# EAGLE design midicontrol_v3 (EAGLE 9.4.0)
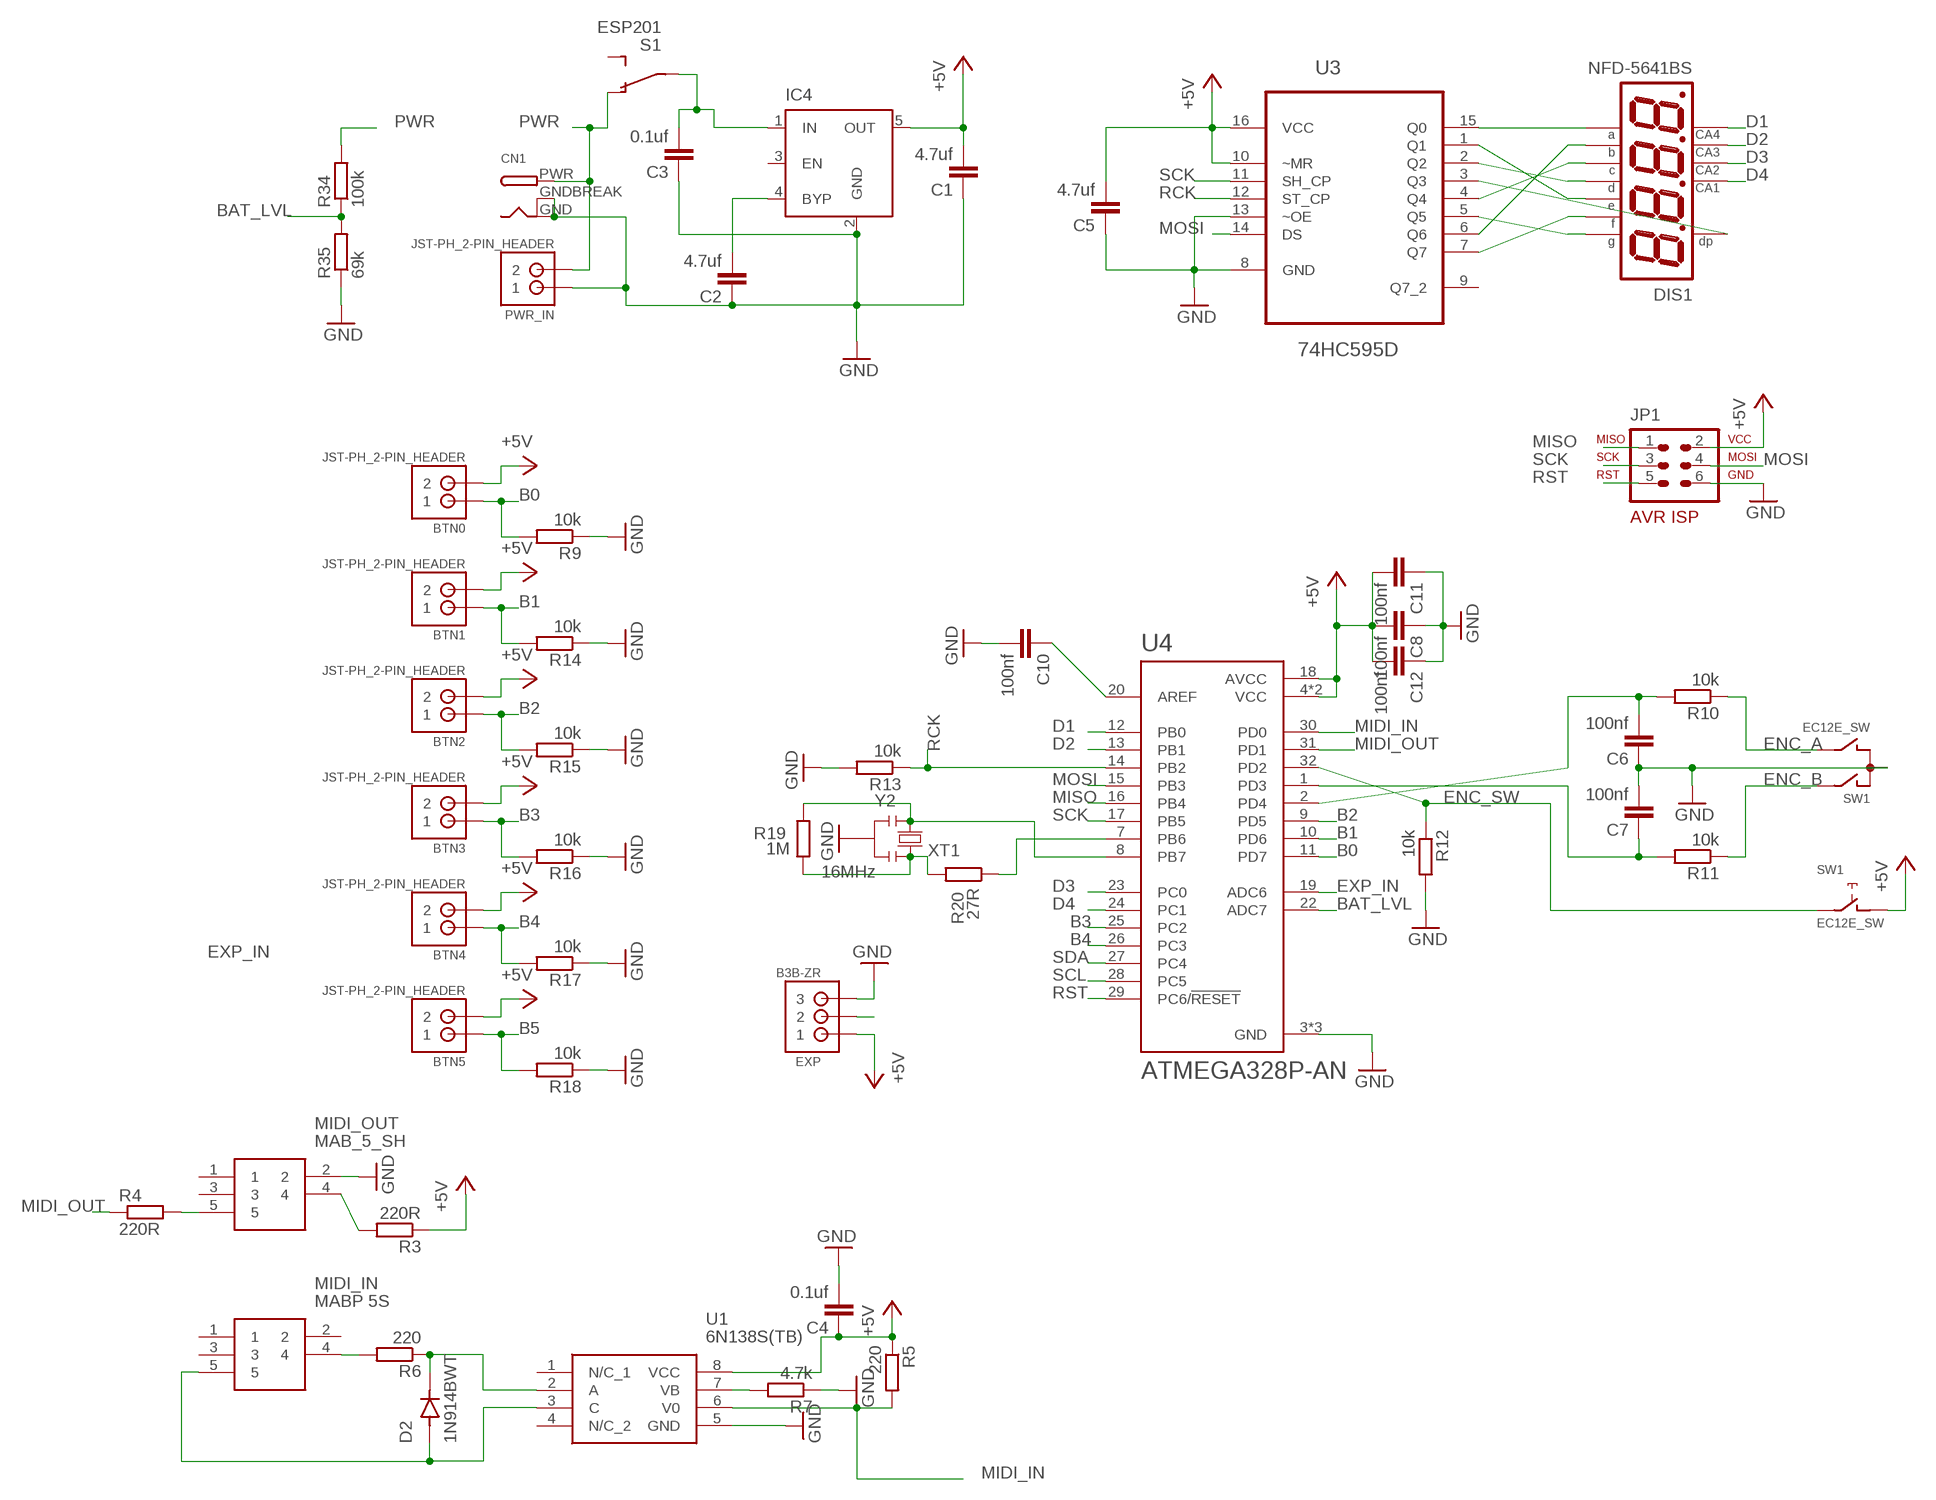
[diagram p0: schematic, sheet 1]

## Parts
BTN0  JST-PH_2-PIN_HEADER  [JST_B2B-PH_HEADER]
BTN1  JST-PH_2-PIN_HEADER  [JST_B2B-PH_HEADER]
BTN2  JST-PH_2-PIN_HEADER  [JST_B2B-PH_HEADER]
BTN3  JST-PH_2-PIN_HEADER  [JST_B2B-PH_HEADER]
BTN4  JST-PH_2-PIN_HEADER  [JST_B2B-PH_HEADER]
BTN5  JST-PH_2-PIN_HEADER  [JST_B2B-PH_HEADER]
C1  4.7uf  C-EUC1206  [C1206]
C2  4.7uf  C-EUC1206  [C1206]
C3  0.1uf  C-EUC1206  [C1206]
C4  0.1uf  C-EUC0603  [C0603]
C5  4.7uf  C-EUC0603  [C0603]
C6  100nf  C-EUC0603  [C0603]
C7  100nf  C-EUC0603  [C0603]
C8  100nf  C-EUC1206  [C1206]
C10  100nf  C-EUC0603  [C0603]
C11  100nf  C-EUC0603  [C0603]
C12  100nf  C-EUC0603  [C0603]
CN1  DCBARRELPTH  [DCJACK_2MM_PTH]
D2  1N914BWT  [SODFL1608X70N]
DIS1  NFD-5641BS  [NFD-5641]
EXP  B3B-ZR  [B3B-ZR]
IC4  MIC5219XX  [SOT23-5]
JP1  AVR-ISP-6HORZ  [AVR-ISP-6R]
MIDI_IN  MABP 5S  MAB_5_SH  [MAB-5-SH]
MIDI_OUT  MAB_5_SH  [MAB-5-SH]
PWR_IN  JST-PH_2-PIN_HEADER  [JST_B2B-PH_HEADER]
R3  220R  R-EU_R0603  [R0603]
R4  220R  R-EU_R0603  [R0603]
R5  220  R-EU_R0603  [R0603]
R6  220  R-EU_R0603  [R0603]
R7  4.7k  R-EU_R0603  [R0603]
R9  10k  R-EU_R0603  [R0603]
R10  10k  R-EU_R0603  [R0603]
R11  10k  R-EU_R0603  [R0603]
R12  10k  R-EU_R0603  [R0603]
R13  10k  R-EU_R0603  [R0603]
R14  10k  R-EU_R0603  [R0603]
R15  10k  R-EU_R0603  [R0603]
R16  10k  R-EU_R0603  [R0603]
R17  10k  R-EU_R0603  [R0603]
R18  10k  R-EU_R0603  [R0603]
R19  1M  R-EU_R0603  [R0603-ROUND]
R20  27R  R-EU_R0603  [R0603-ROUND]
R34  100k  R-EU_R0603  [R0603]
R35  69k  R-EU_R0603  [R0603]
S1  ESP201  [ESP201]
SW1  EC12E_SW  [ALPS_EC12E_SW]
U1  6N138S(TB)  [SOP254P1030X460-8N]
U3  74HC595D  [SOIC127P600X175-16N]
U4  ATMEGA328P-AN  [QFP80P900X900X120-32N]
Y2  16MHz  RESONATORMU  [RESONATOR]

## Nets
+5V: BTN0.P2 BTN1.P2 BTN2.P2 BTN3.P2 BTN4.P2 BTN5.P2 C1.2 C4.1 C5.2 C8.2 C11.2 C12.2 EXP.1 IC4.5(OUT) JP1.2 R3.1 R5.1 SW1.D U1.8(VCC) U3.10(~MR) U3.16(VCC) U4.4(VCC) U4.6(VCC) U4.18(AVCC)
B0: BTN0.P1 R9.2 U4.11(PD7)
B1: BTN1.P1 R14.2 U4.10(PD6)
B2: BTN2.P1 R15.2 U4.9(PD5)
B3: BTN3.P1 R16.2 U4.25(PC2)
B4: BTN4.P1 R17.2 U4.26(PC3)
B5: BTN5.P1 R18.2
BAT_LVL: R34.1 R35.2 U4.22(ADC7)
D1: DIS1.P$6 U4.12(PB0)
D2: DIS1.P$8 U4.13(PB1)
D3: DIS1.P$9 U4.23(PC0)
D4: DIS1.P$12 U4.24(PC1)
ENC_A: R10.1 SW1.B
ENC_B: R11.1 SW1.A
ENC_SW: R12.1 SW1.E U4.32(PD2)
EXP_IN: EXP.2 U4.19(ADC6)
GND: C1.1 C2.1 C3.1 C4.2 C5.1 C6.1 C7.2 C8.1 C10.2 C11.1 C12.1 CN1.GND CN1.GNDBREAK EXP.3 IC4.2(GND) JP1.6 MIDI_OUT.2 PWR_IN.P1 R7.1 R9.1 R12.2 R13.2 R14.1 R15.1 R16.1 R17.1 R18.1 R35.1 SW1.C U1.5(GND) U3.8(GND) U3.13(~OE) U4.3(GND) U4.5(GND) U4.21(GND) Y2.2
MIDI_IN: R5.2 U1.6(V0) U4.30(PD0)
MIDI_OUT: R4.1 U4.31(PD1)
MISO: JP1.1 U4.16(PB4)
MOSI: JP1.4 U3.14(DS) U4.15(PB3)
N$1: DIS1.P$11 U3.15(Q0)
N$2: DIS1.P$7 U3.6(Q6)
N$3: DIS1.P$4 U3.4(Q4)
N$4: DIS1.P$2 U3.2(Q2)
N$5: DIS1.P$1 U3.1(Q1)
N$6: DIS1.P$10 U3.7(Q7)
N$7: DIS1.P$5 U3.5(Q5)
N$8: DIS1.P$3 U3.3(Q3)
N$9: MIDI_OUT.4 R3.2
N$10: MIDI_OUT.5 R4.2
N$11: D2.A MIDI_IN.5 U1.3(C)
N$12: D2.C(K) R6.1 U1.2(A)
N$13: MIDI_IN.4 R6.2
N$14: R7.2 U1.7(VB)
N$15: C6.2 R10.2 U4.2(PD4)
N$16: R20.1 U4.7(PB6)
N$17: C7.1 R11.2 U4.1(PD3)
N$20: C2.2 IC4.4(BYP)
N$21: C10.1 U4.20(AREF)
N$26: C3.2 IC4.1(IN) S1.P$1(P)
PWR: CN1.PWR PWR_IN.P2 R34.2 S1.P$3(O)
RCK: R13.1 U3.12(ST_CP) U4.14(PB2)
RST: JP1.5 U4.29(PC6/!RESET)
SCK: JP1.3 U3.11(SH_CP) U4.17(PB5)
SCL: U4.28(PC5)
SDA: U4.27(PC4)
XT1: R19.1 R20.2 Y2.3
XTAL2: R19.2 U4.8(PB7) Y2.1
Unconnected: IC4.3(EN) MIDI_IN.1 MIDI_IN.2 MIDI_IN.3 MIDI_OUT.1 MIDI_OUT.3 S1.P$2(S) SW1.GND1(G) SW1.GND2(G) U1.1(N/C_1) U1.4(N/C_2) U3.9(Q7_2)

## Library data of the parts
BTN0 BTN1-BTN5 PWR_IN = srg:JST-PH_2-PIN_HEADER: 2-pin JST PH Shrouded Header, top entry P/N B2B-PH-K-S Mating connector PHR-2 Mating cable assembly: Sparkfun PRT-09914 <http://www.sparkfun.com/products/9914>
C1-C8 C10-C12 = rcl:C-EU: CAPACITOR, European symbol; SPICEPREFIX: C
CN1 = adafruit:DCBARREL: 2.0mm DC Barrel Jack DCJACK_2MM_PTH - Through Hole Jack (4UConnector: 05537)
D2 = 1N914BWT:1N914BWT: 1N914B Series 75 V 300 mA Surface Mount Small Signal Diode - SOD-523F; AVAILABILITY: Unavailable; DESCRIPTION: 1N914B Series 75 V 300 mA Surface Mount Small Signal Diode - SOD-523F; MF: ON Semiconductor; MP: 1N914BWT; PACKAGE: SOD-523F ON Semiconductor; PRICE: None
DIS1 = display-misc:NFD-5641BS: Four Digit 0.56" CA Seven-Segment LED Display Futurlec part number: 7FR5641BS Created by RobG
EXP = jst:B3B-ZR: JST-ZH Connector 3 pol, 1.5mm pitch Package: B3B-ZR Source: http://www.jst-mfg.com/product/pdf/eng/eZH.pdf
IC4 = v-reg-micrel:MIC5219XX: VOLTAGE REGULATOR; OC_FARNELL: unknown; OC_NEWARK: unknown
JP1 = avr-7:AVR-ISP-6: AVR ISP-6 Serial Programming Header
MIDI_IN MIDI_OUT = MAB_5_SH:MAB_5_SH: HIRSCHMANN - MAB 5 SH - SOCKET, DIN, PCB, 5PIN Source: Datasheet <http://www.farnell.com/datasheets/1599432.pdf>; DESCRIPTION: HIRSCHMANN - MAB 5 SH - SOCKET, DIN, PCB, 5PIN; HEIGHT: mm; MANUFACTURER_NAME: Hirschmann; MANUFACTURER_PART_NUMBER: MAB 5 SH
R3-R7 R9-R18 R34 R35 = rcl:R-EU_: RESISTOR, European symbol; SPICEPREFIX: R
R19 R20 = SmartPrj:R-EU_: RESISTOR, European symbol
S1 = olli:ESP201: Switch ESP201 available at reichelt.de
SW1 = switch-alps:EC12E_SW: ALPS rotary Encoder EC12E series with switch; MPN: EC12E2424407; OC_FARNELL: 1520813; OC_NEWARK: 74M1068
U1 = 6N138S(TB):6N138S(TB): High Speed Optocouplers Low Input, High Gain DC Input Source: Datasheet <https://componentsearchengine.com/Datasheets/1/6N138S(TB).pdf>; DESCRIPTION: High Speed Optocouplers Low Input, High Gain DC Input; HEIGHT: 4.6mm; MANUFACTURER_NAME: Everlight; MANUFACTURER_PART_NUMBER: 6N138S(TB); MOUSER_PART_NUMBER: 638-6N138STB; MOUSER_PRICE-STOCK: https://www.mouser.com/Search/Refine.aspx?Keyword=638-6N138STB
U3 = 74HC595D:74HC595D: 8-bit serial-in parallel-out shift register; AVAILABILITY: Unavailable; DESCRIPTION: Shift Register Single 8-Bit Serial to Serial/Parallel 16-Pin SO; MF: Toshiba Semiconductor; MP: 74HC595D; PACKAGE: SO-16 NXP Semiconductors; PRICE: None
U4 = ATMEGA328P-AN:ATMEGA328P-AN: ATmega Series 20 MHz 32 KB Flash 2 KB SRAM 8-Bit Microcontroller - TQFP-32; AVAILABILITY: Unavailable; DESCRIPTION: MCU 8-bit ATmega AVR RISC 32KB Flash 2.5V/3.3V/5V 32-Pin TQFP Tray; MF: Microchip; MP: ATMEGA328P-AN; PACKAGE: TQFP-32 Microchip; PRICE: None
Y2 = SmartPrj:RESONATOR

## Net classes
0 default: clearance 0.152 mm

## Board
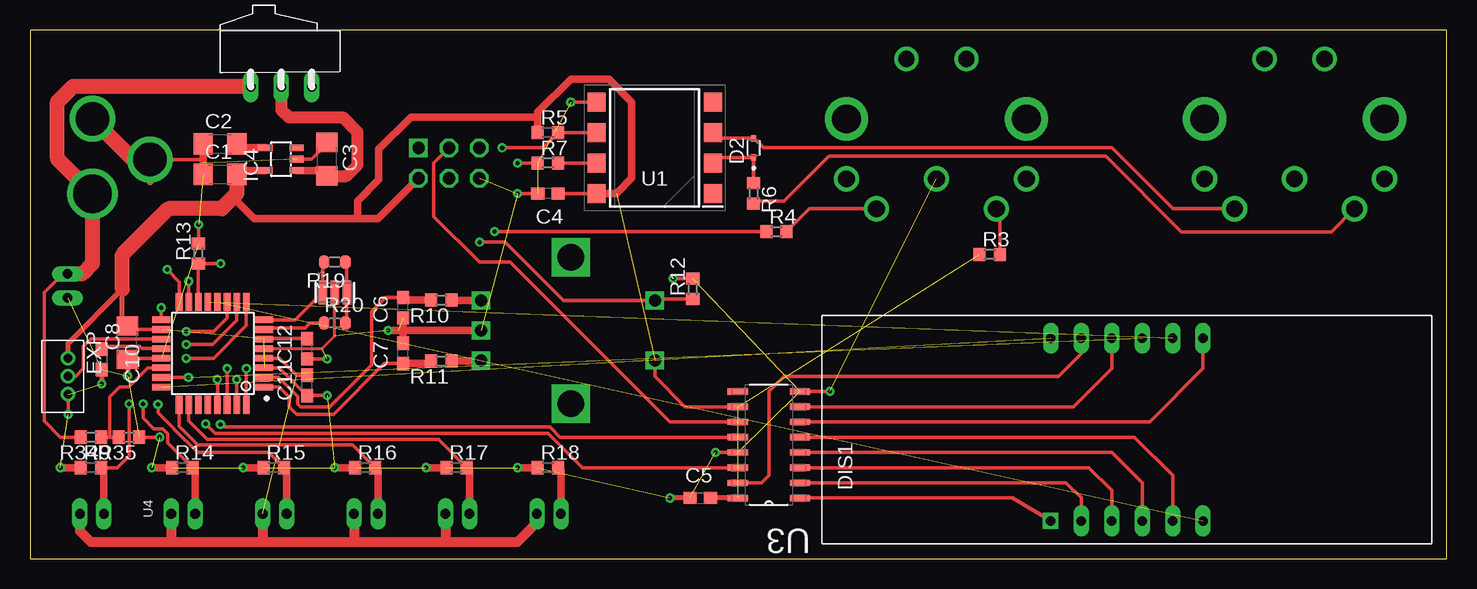
[diagram p1: board, top side]
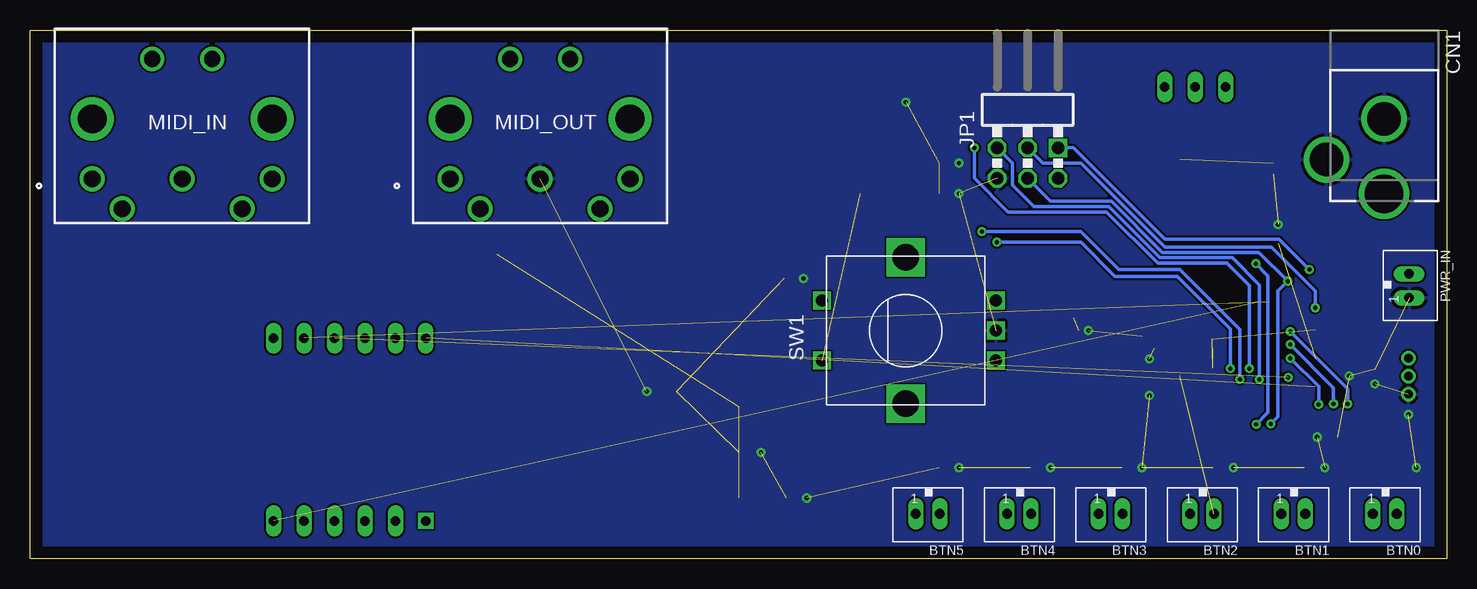
[diagram p2: board, bottom side, seen from below]

Size 118.09 x 44.12 mm. Coordinates in mm from the lower left corner, seen from the top.
Outline: 0,0 118.09,0 118.09,44.12 0,44.12 0,0
Copper layers (1*16): Top 0.035mm / dielectric 1.5mm / Bottom 0.035mm
Design rules "default": minimum track width 6mil, minimum drill 0.35mm, track to track 6mil, track to pad 6mil, pad to pad 6mil, via to via 6mil, smd to smd 6mil, copper to edge 40mil, drill to drill 6mil, minimum pad ring 10mil, minimum via ring 8mil, stop-mask expansion 4mil, vias tented up to drill 0mil, thermal gap 10mil

### Footprints (pad centres in the part's own frame; a part is rotated, then mirrored left to right if it is on the bottom)
JST_B2B-PH_HEADER = drill 0.8 long: P1 1.075,0.048; P2 -0.925,0.048
C1206 = smd 1.6 x 1.8: 1 -1.4,0; 2 1.4,0
C0603 = smd 1.1 x 1: 1 -0.85,0; 2 0.85,0
DCJACK_2MM_PTH = drill 2.8: GND 0,7.35; GNDBREAK 4.8,10.75 | drill 3.2: PWR 0,13.6
SODFL1608X70N = smd 0.53 x 0.4: A 0.8,0; C -0.8,0
NFD-5641 = drill 0.8 square: P$1 -6.35,-7.62 | drill 0.8 long: P$2 -3.81,-7.62; P$3 -1.27,-7.62; P$4 1.27,-7.62; P$5 3.81,-7.62; P$6 6.35,-7.62; P$7 6.35,7.62; P$8 3.81,7.62; P$9 1.27,7.62; P$10 -1.27,7.62; P$11 -3.81,7.62; P$12 -6.35,7.62
B3B-ZR = drill 0.7 pad 1.1: 1 -1.5,0; 2 0,0; 3 1.5,0
SOT23-5 = smd 0.55 x 1.2: 1 -0.95,-1.3; 2 0,-1.3; 3 0.95,-1.3; 4 0.95,1.3; 5 -0.95,1.3
AVR-ISP-6R = drill 1.016 square: 1 -2.54,-1.27 | drill 1.016 octagon: 2 -2.54,1.27; 3 0,-1.27; 4 0,1.27; 5 2.54,-1.27; 6 2.54,1.27
MAB-5-SH = drill 1.4 pad 2.1: 1 7.5,-2.5; 2 0,-2.5; 3 -7.5,-2.5; 4 5,0; 5 -5,0 | drill 1.35 pad 2: 6 -2.5,-12.5; 7 2.5,-12.5 | drill 2.4 pad 3.6: 8 -7.5,-7.5; 9 7.5,-7.5
R0603 = smd 1 x 1.1: 1 -0.85,0; 2 0.85,0
R0603-ROUND = smd 0.898 x 1.1: 1 -0.889,0; 2 0.889,0
ESP201 = drill 0.8 long: P$1 0,0; P$2 2.54,0; P$3 -2.54,0
ALPS_EC12E_SW = drill 1 square: A -2.5,-7.5; B 2.5,-7.5; C 0,-7.5; D -2.5,7; E 2.5,7 | drill 2.2 square: GND1 -6.1,0; GND2 6.1,0
SOP254P1030X460-8N = smd 1.5 x 1.6: 1 -4.85,3.81; 2 -4.85,1.27; 3 -4.85,-1.27; 4 -4.85,-3.81; 5 4.85,-3.81; 6 4.85,-1.27; 7 4.85,1.27; 8 4.85,3.81
SOIC127P600X175-16N = smd 1.702 x 0.533: 1 -2.591,4.445; 2 -2.591,3.175; 3 -2.591,1.905; 4 -2.591,0.635; 5 -2.591,-0.635; 6 -2.591,-1.905; 7 -2.591,-3.175; 8 -2.591,-4.445; 9 2.591,-4.445; 10 2.591,-3.175; 11 2.591,-1.905; 12 2.591,-0.635; 13 2.591,0.635; 14 2.591,1.905; 15 2.591,3.175; 16 2.591,4.445
QFP80P900X900X120-32N = smd 1.5 x 0.55: 1 -4.3,2.8; 2 -4.3,2; 3 -4.3,1.2; 4 -4.3,0.4; 5 -4.3,-0.4; 6 -4.3,-1.2; 7 -4.3,-2; 8 -4.3,-2.8; 17 4.3,-2.8; 18 4.3,-2; 19 4.3,-1.2; 20 4.3,-0.4; 21 4.3,0.4; 22 4.3,1.2; 23 4.3,2; 24 4.3,2.8 | smd 0.55 x 1.5: 9 -2.8,-4.3; 10 -2,-4.3; 11 -1.2,-4.3; 12 -0.4,-4.3; 13 0.4,-4.3; 14 1.2,-4.3; 15 2,-4.3; 16 2.8,-4.3; 25 2.8,4.3; 26 2,4.3; 27 1.2,4.3; 28 0.4,4.3; 29 -0.4,4.3; 30 -1.2,4.3; 31 -2,4.3; 32 -2.8,4.3
RESONATOR = smd 0.7 x 2: 1 -1,0; 2 0,0; 3 1,0

### Placement (x,y rotation side)
BTN0  5.08,3.81 180 bottom
BTN1  12.7,3.81 180 bottom
BTN2  20.32,3.81 180 bottom
BTN3  27.94,3.81 180 bottom
BTN4  35.56,3.81 180 bottom
BTN5  43.18,3.81 180 bottom
C1  15.85,32.08 0 top
C2  15.85,34.62 0 top
C3  24.74,33.35 270 top
C4  43.18,30.48 180 top
C5  55.88,5.08 0 top
C6  31.12,20.95 90 top
C7  31.12,17.15 90 top
C8  8.13,18.03 90 top
C10  5.97,16.64 270 top
C11  23.11,14.48 90 top
C12  23.11,17.53 90 top
CN1  5.21,44.07 180 bottom
D2  60.32,34.29 90 top
DIS1  91.44,10.79 0 top
EXP  3.17,15.24 270 top
IC4  20.93,33.35 90 top
JP1  34.92,33.02 180 bottom
MIDI_IN  105.41,29.21 180 bottom
MIDI_OUT  75.57,29.21 180 bottom
PWR_IN  3.17,22.86 270 bottom
R3  80.01,25.4 0 top
R4  62.23,27.3 0 top
R5  43.18,35.56 0 top
R6  60.32,30.48 270 top
R7  43.18,33.02 0 top
R9  5.08,7.62 0 top
R10  34.29,21.59 180 top
R11  34.29,16.51 180 top
R12  55.24,22.53 90 top
R13  14.05,25.48 90 top
R14  12.7,7.62 0 top
R15  20.32,7.62 0 top
R16  27.94,7.62 0 top
R17  35.56,7.62 0 top
R18  43.18,7.62 0 top
R19  25.4,24.76 180 top
R20  25.4,19.68 0 top
R34  5.08,10.16 180 top
R35  8.26,10.16 180 top
S1  20.96,39.37 0 top
SW1  45.09,19.05 90 bottom
U1  52.07,34.29 180 top
U3  61.59,9.52 180 top
U4  15.24,17.15 180 top
Y2  25.4,22.23 0 top

### Tracks (layer width: path | path; a pad name or v marks a point on that pad's centre or on a via)
+5V  (6 unrouted)
  Top 0.305: U4.6 19.57,18.38 C12.2 | C11.2 22.23,15.33 20.81,16.74 U4.4 | C8.2 8.39,19.15 U4.18 | C4.1 U1.8 | U3.10 54.61,12.7 52.09,15.23 SW1.D
  Top 0.406: U3.16 C5.2 | EXP.1 3.17,17.98 7.7,22.5 7.7,19.87 C8.2
  Top 0.61: IC4.5 17.12,32.4 17.12,32.21 C1.2 17.25,29.84 18.7,28.4 27.31,28.4 | JP1.2 29.03,28.4 27.31,28.4 | U1.8 48.89,30.48 50.16,31.75 50.16,38.1 48.26,40.01 45.09,40.01 42.33,37.25 42.33,36.83 | 42.33,36.83 R5.1 | 27.31,28.4 27.31,29.84 29.08,31.62 29.08,34.16 31.75,36.83 42.33,36.83
  Top 0.813: BTN1.P2 11.78,1.42 | 11.78,1.42 19.43,1.42 | 19.43,1.42 27.05,1.42 | 27.05,1.42 34.67,1.42 | 34.67,1.42 40.64,1.42 42.25,3.04 BTN5.P2 | BTN2.P2 19.4,1.46 19.43,1.42 | BTN3.P2 27.02,1.46 27.05,1.42 | BTN4.P2 34.63,1.46 34.67,1.42 | 11.78,1.42 5.08,1.42 4.16,2.35 BTN0.P2
  Top 1.27: C1.2 17.25,30.48 15.98,29.21 11.53,29.21 7.7,25.37 7.7,22.5
B0  (via drill 0.35)
  Top 0.305: R9.2 7.29,7.62 8.26,8.59 v8.26,12.93 | U4.11 16.44,20.1 15.32,18.97 v13.03,18.97
  Top 0.61: R9.2 6.15,7.39 BTN0.P1
  Bottom 0.305: v13.03,18.97 8.26,14.2 v8.26,12.93
B1  (via drill 0.35)
  Top 0.305: v9.42,12.93 9.42,11.75 10.33,10.84 11.08,10.84 11.48,10.44 11.48,9.69 R14.2 | U4.10 17.24,19.88 15.24,17.88 v13.03,17.88
  Top 0.61: R14.2 13.78,7.39 BTN1.P1
  Bottom 0.305: v13.03,17.88 9.42,14.27 v9.42,12.93
B2  (via drill 0.35)
  Top 0.305: R15.2 19.9,8.89 13.96,8.89 11.98,10.87 11.98,10.88 10.67,12.19 v10.67,12.9 | U4.9 18.04,19.46 15.32,16.74 v13.03,16.74
  Top 0.61: R15.2 21.4,7.39 BTN2.P1
  Bottom 0.305: v13.03,16.74 10.67,14.38 v10.67,12.9
B3
  Top 0.305: U4.25 12.44,11.05 13.97,9.52 26.89,9.52 R16.2
  Top 0.61: R16.2 29.02,7.39 BTN3.P1
B4
  Top 0.305: U4.26 13.24,11.52 14.78,9.98 34.05,9.98 R17.2
  Top 0.61: R17.2 36.63,7.39 BTN4.P1
B5
  Top 0.61: R18.2 44.25,7.39 BTN5.P1
BAT_LVL
  Top 0.305: R34.1 6.65,10.16 | 6.65,10.16 R35.2 | U4.22 9.82,15.95 8.23,14.35 7.49,14.35 6.65,13.51 6.65,10.16
D1  (1 unrouted)
D2  (1 unrouted)
D3  (via drill 0.35)  (1 unrouted)
  Top 0.305: U4.23 v13.21,15.15
D4  (1 unrouted)
ENC_A
  Top 0.61: SW1.B 35.18,21.55 R10.1
ENC_B
  Top 0.61: SW1.A 37.54,16.51 R11.1
ENC_SW  (via drill 0.35)
  Top 0.305: R12.1 52.21,21.68 SW1.E 44.49,21.55 39.62,26.42 v37.49,26.42 | U4.32 v18.04,15.87
  Bottom 0.305: v18.04,15.87 18.04,19.18 22.43,23.57 27.64,23.57 30.48,26.42 v37.49,26.42
EXP_IN
  Top 0.305: U4.19 9.17,18.34 9.15,18.33 7.1,18.33 7.09,18.34 5.08,18.34 4.45,17.71 4.45,15.87 3.81,15.24 EXP.2
GND  (via drill 0.35)  (27 unrouted)
  Top 0.254: U4.5 24.37,17.55 25.4,18.58 Y2.2
  Top 0.305: U4.3 20.76,15.95 23.08,13.63 C11.1 v24.77,13.63 | IC4.2 23.47,33.35 24.74,34.62 C3.1 | C12.1 v24.77,16.68 | U3.8 v66.68,13.97 | U3.13 v57.15,8.89 | U4.21 8.57,16.74 C8.1 | EXP.3 v3.17,12.06 | R35.1 v10.79,10.16 | R12.2 v53.62,23.38 | C4.2 v40.64,30.48 | R7.1 v40.64,33.02 | U1.5 v45.09,38.1 | R13.2 v14.05,27.89 | CN1.GNDBREAK 14.15,33.32 14.45,33.02
  Top 0.406: C5.1 v53.34,5.08 | C10.2 v5.97,14.6 | C8.1 v8.13,15.26
  Top 0.61: C2.1 14.45,33.02 C1.1 | R9.1 v2.54,7.62 | R14.1 v10.16,7.62 | R15.1 v17.78,7.62 | R16.1 v25.4,7.62 | R17.1 v33.02,7.62 | R18.1 v40.64,7.62 | 10.01,31.48 CN1.GNDBREAK | C6.1 C7.2 | 30.7,19.05 v29.85,19.05 SW1.C
  Top 1.27: CN1.GND 8.61,33.32 CN1.GNDBREAK
  pour Bottom: -6.99,48.26 -6.99,-8.89 139.06,-8.89 139.06,49.53 -5.71,49.53
MIDI_IN  (via drill 0.35)
  Top 0.305: U1.6 R5.2 42.76,34.29 v39.37,34.29 | U4.30 v16.44,15.87
  Bottom 0.305: v16.44,15.87 16.44,22.79 18.31,24.66 24.08,24.66 28.34,28.93 36.55,28.93 39.37,31.75 v39.37,34.29
MIDI_OUT  (via drill 0.35)
  Top 0.305: v17.22,14.99 17.22,12.86 U4.31 | v38.73,27.3 R4.1
  Bottom 0.305: v17.22,14.99 17.22,19.13 22.23,24.13 27.31,24.13 30.48,27.3 v38.73,27.3
MISO  (via drill 0.35)
  Top 0.305: v11.43,24.13 12.44,23.12 U4.16
  Bottom 0.305: v11.43,24.13 13.97,26.67 23.5,26.67 31.12,34.29 JP1.1
MOSI  (via drill 0.35)
  Top 0.305: U4.15 v13.24,23.16 | U3.14 46.08,7.62 43.2,10.49 15.44,10.49 v14.66,11.28
  Bottom 0.305: JP1.4 33.02,29.84 27.96,29.84 23.7,25.58 15.65,25.58 v13.24,23.16 14.07,22.33 14.07,11.86 v14.66,11.28
N$1
  Top 0.305: U3.15 60.96,6.35 61.59,6.98 61.59,13.97 62.86,15.24 85.73,15.24 87.63,17.15 DIS1.P$11
N$2
  Top 0.305: DIS1.P$7 97.79,15.87 93.34,11.43 U3.6
N$3
  Top 0.305: U3.4 90.17,8.89 92.71,6.35 DIS1.P$4
N$4
  Top 0.305: U3.2 86.36,6.35 87.63,5.08 DIS1.P$2
N$5
  Top 0.305: U3.1 81.92,5.08 DIS1.P$1
N$6
  Top 0.305: DIS1.P$10 90.17,15.87 87,12.7 U3.7
N$7
  Top 0.305: U3.5 92.08,10.16 95.25,6.98 DIS1.P$5
N$8
  Top 0.305: U3.3 88.27,7.62 90.17,5.71 DIS1.P$3
N$9
  Top 0.305: MIDI_OUT.4 80.86,28.91 R3.2
N$10
  Top 0.305: MIDI_OUT.5 64.98,29.21 R4.2
N$11
  Top 0.305: U1.3 57.39,35.09 D2.A 61.12,34.29 90.17,34.29 95.25,29.21 MIDI_IN.5
N$12
  Top 0.305: U1.2 57.39,33.49 D2.C R6.1
N$13
  Top 0.305: R6.2 60.54,29.84 62.86,29.84 66.6,33.58 89.69,33.58 95.99,27.28 108.48,27.28 MIDI_IN.4
N$14
  Top 0.305: R7.2 U1.7
N$15
  Top 0.305: U4.2 20.72,15.15 22.31,13.56 22.31,12.95 22.56,12.7 24.99,12.7 28.47,16.18 28.47,20.62 29.65,21.8 C6.2
  Top 0.61: R10.2 31.33,21.59 C6.2
N$16
  Top 0.305: R20.1 23.37,19.68 22.96,19.27 19.67,19.27 U4.7
N$17
  Top 0.305: U4.1 20.76,14.34 21.59,13.51 21.59,12.7 22.23,12.06 25.3,12.06 29.53,16.29 C7.1
  Top 0.61: R11.2 33.23,16.29 C7.1
N$20
  Top 0.61: IC4.4 17.57,34.3 C2.2
N$21
  Top 0.305: U4.20 9.35,17.54 9.15,17.74 6.22,17.74 C10.1
N$26
  Top 0.61: IC4.1 24.29,32.4 C3.2
  Top 1.016: S1.P$1 20.96,37.46 21.59,36.83 26.09,36.83 27.31,35.61 27.31,32.87 26.39,31.95 C3.2
PWR
  Top 0.305: R34.2 2.54,10.16 1.17,11.53 1.17,22.23 2.73,23.79 PWR_IN.P2
  Top 1.27: PWR_IN.P2 4.35,23.79 5.21,24.64 CN1.PWR 2.29,33.39 2.29,38.1 3.6,39.41 18.37,39.41 S1.P$3
RCK  (via drill 0.35)
  Top 0.305: U4.14 R13.1 v15.9,24.63 | v15.88,11.22 16.1,11 43.34,11 44.18,10.16 U3.12
  Bottom 0.305: v15.88,11.22 14.88,12.21 14.88,23.61 v15.9,24.63
RST  (via drill 0.35)
  Top 0.305: v15.62,14.99 15.64,14.97 U4.29
  Bottom 0.305: JP1.5 36.2,33.02 36.2,31.19 34.39,29.39 28.15,29.39 23.89,25.12 17.88,25.12 15.62,22.86 v15.62,14.99
SCK  (via drill 0.35)
  Top 0.305: 10.54,19.95 U4.17 v10.94,20.95 | U3.11 53.34,11.43 40,24.76 37.46,24.76 33.66,28.57 33.66,33.02 JP1.3
  Bottom 0.305: JP1.3 33.66,33.02 30.49,33.02 23.51,26.04 14.61,26.04 10.94,22.37 v10.94,20.95
XT1
  Top 0.305: R19.1 26.4,24.65 Y2.3 26.4,19.8 R20.2
XTAL2
  Top 0.305: R19.2 24.4,24.65 Y2.1 22.12,19.95 U4.8